# Altium schematic sheet AnalogMeasurements.SchDoc
size A4; SheetNumber: 3; SheetTotal: 8; SPICEModelCacheMURSBSRZ: <root> / <DocumentId>MURSBSRZ</DocumentId> / </root>
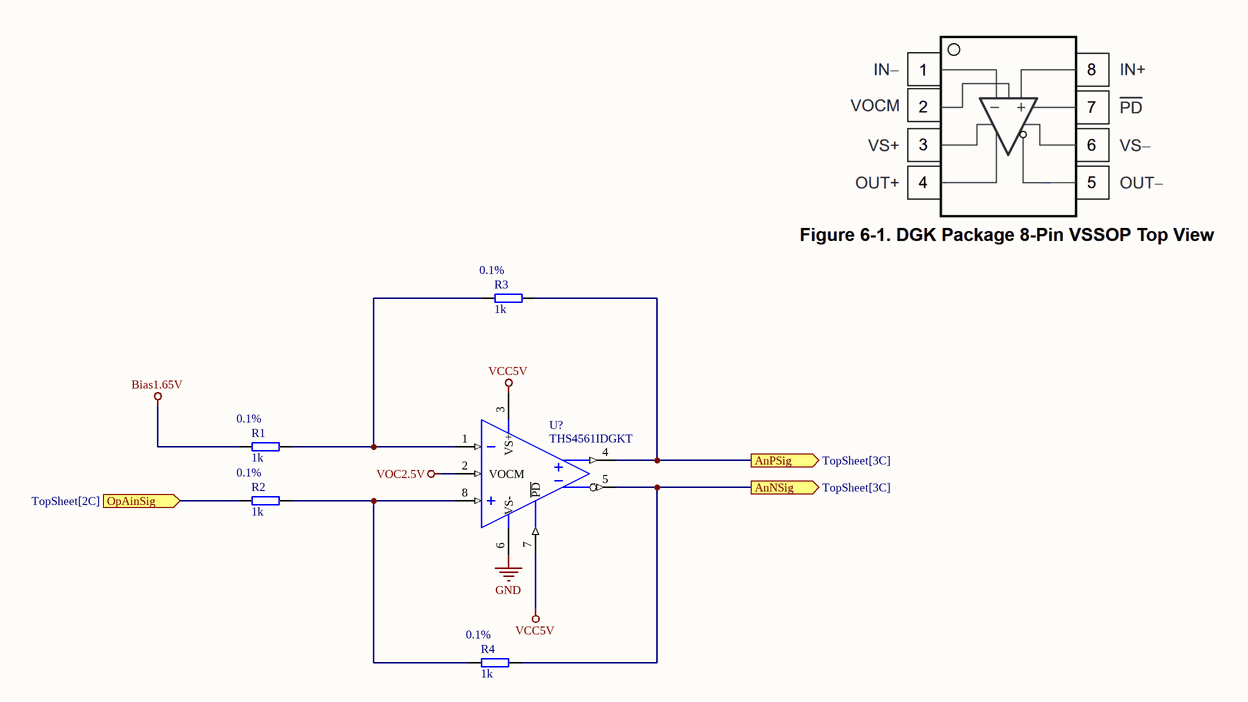
[diagram p0: AnalogMeasurements.SchDoc]

## Parts
R1  1k  Tolerance: 0.1%  [RES 0603_1608]
R2  1k  Tolerance: 0.1%  [RES 0603_1608]
R3  1k  Tolerance: 0.1%  [RES 0603_1608]
R4  1k  Tolerance: 0.1%  [RES 0603_1608]
U?  THS4561IDGKT  [SOP65P490X110-8N]

## Ports
AnNSig (out, see TopSheet[3C]), AnPSig (out, see TopSheet[3C]), OpAinSig (in, see TopSheet[2C])

## Nets
Bias1.65V: R1.1
GND: U?.6(VS-)
VCC5V: U?.3(VS+) U?.7(~{PD})
VOC2.5V: U?.2(VOCM)
AnNSig: R4.2 U?.5(VOUT-) ; port AnNSig
AnPSig: R3.2 U?.4(VOUT+) ; port AnPSig
OpAinSig: R2.1 ; port OpAinSig
NetR1_2: R1.2 R3.1 U?.1(VIN-)
NetR2_2: R2.2 R4.1 U?.8(VIN+)

## Library data of the parts
R1-R4 = PCF-W0603LF-03-1001-B-P-LT: SMD resistor 0.1%; Manufacturer: IRC / TT Electronics; Created from: MGremer; Manufacturer Part Number: PCF-W0603LF-03-1001-B-P-LT; PartID: 163; Created On: 14/12/2020 16:17:14; ComponentLink1Description: Datasheet; ComponentLink1URL: https://www.mouser.de/datasheet/2/414/PCF-1528243.pdf; Component Type: SMD resistor; Device Package: 0603; Last Updated: 21/02/2024 15:45:55; Mounting Type: SMD; Supplier 1: Mouser; Supplier Part Number 1: 66-PCFW0603LF031001B; Type: Resistor; Value: 1k; Live Cycle Status: 1; Stock number: not stored; LCSC Part Number: C110776
U? = THS4561IDGKT: Fully Differential Amplifier, Low-Power, High Supply Range, 60-MHz; Manufacturer: Texas Instruments; Channels: 1; GBP: 68 MHz; CMRR: 110 dB; Value: Rail-to-Rail; Created from: DHufnagel; Manufacturer Part Number: THS4561IDGKT; PartID: 13; Created On: 08/07/2022 14:29:07; ComponentLink1Description: Datasheet; ComponentLink1URL: https://www.ti.com/general/docs/suppproductinfo.tsp?distId=26&gotoUrl=https://www.ti.com/lit/gpn/ths4561; Component Type: Differential Amplifier; Device Package: VSSOP-8; Last Updated: 30/09/2024 15:54:43; Mounting Type: SMD; Operating Temperature: -40 to +125 °C; Series: THS4561; Supplier 1: Mouser; Supplier Part Number 1: 595-THS4561IDGKT; Supplier 2: Digi-Key; Supplier Part Number 2: 296-THS4561IDGKTCT-ND; Type: Differential Amplifiers; Live Cycle Status: 1; Stock number: not stored